# EAGLE design 2output (EAGLE 6.5.0)
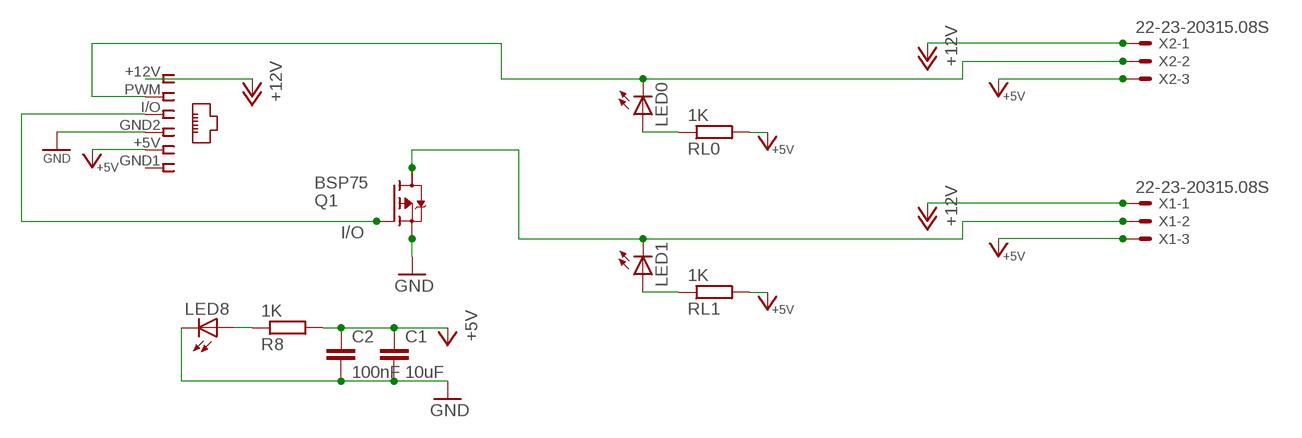
[diagram p0: schematic, sheet 1]

## Parts
C1  10uF  C-EUC1206  [C1206]
C2  100nF  C-EUC1206  [C1206]
I/O_PWM  I2C 1  RJ12STRAIGHT  [RJ12-STRAIGHT]
LED0  LED1206  [LED-1206]
LED1  LED1206  [LED-1206]
LED8  LED1206  [LED-1206]
Q1  BSP75  BSP613P  [PG-SOT-223]
R8  1K  R-EU_M1206  [M1206]
RL0  1K  R-EU_M1206  [M1206]
RL1  1K  R-EU_M1206  [M1206]
X1  22-23-20315.08S  [3-PIN-5.08S]
X2  22-23-20315.08S  [3-PIN-5.08S]

## Nets
+5V [highpower]: C1.1 C2.1 I/O_PWM.+5V R8.2 RL0.2 RL1.2 X1.3 X2.3
+12V [highpower]: I/O_PWM.+12V X1.1 X2.1
GND [highpower]: C1.2 C2.2 I/O_PWM.GND2 LED8.C Q1.3(S)
I/O: I/O_PWM.I/O Q1.1(G)
N$1 [power]: LED1.C Q1.2(D) X1.2
N$2: LED0.A RL0.1
N$4: LED1.A RL1.1
N$23: LED8.A R8.1
PWM [power]: I/O_PWM.PWM LED0.C X2.2
Unconnected: I/O_PWM.GND1 Q1.4(D)

## Library data of the parts
C1 C2 = rcl:C-EU: CAPACITOR, European symbol
I/O_PWM = lpatiny:RJ12: CORCOM Modular RJ Jacks No Shield Source: www.tycoelectronics.com .. ENG_DS_1654001_1099_RJ_L_0507.pdf
LED0 LED1 LED8 = SparkFun:LED: LEDs Standard schematic elements and footprints for 5mm, 3mm, 1206, and 0603 sized LEDs. 5mm - Spark Fun Electronics SKU : COM-00529 (and others)
Q1 = infineon:BSP613P: SIPMOS (R) Small-Signal-Transistor P-Channel (2 Drain) Source: http://www.infineon.com/dgdl/BSP613P_Rev2.4.pdf; OC_FARNELL: unknown; OC_NEWARK: unknown
R8 RL0 RL1 = resistor:R-EU_: RESISTOR, European symbol
X1 X2 = lpatiny:22-23-2031: .100" (2.54mm) Center Header - 3 Pin

## Net classes
0 default: width 0.61 mm
1 power: width 1.372 mm
2 highpower: width 1.372 mm

## Board
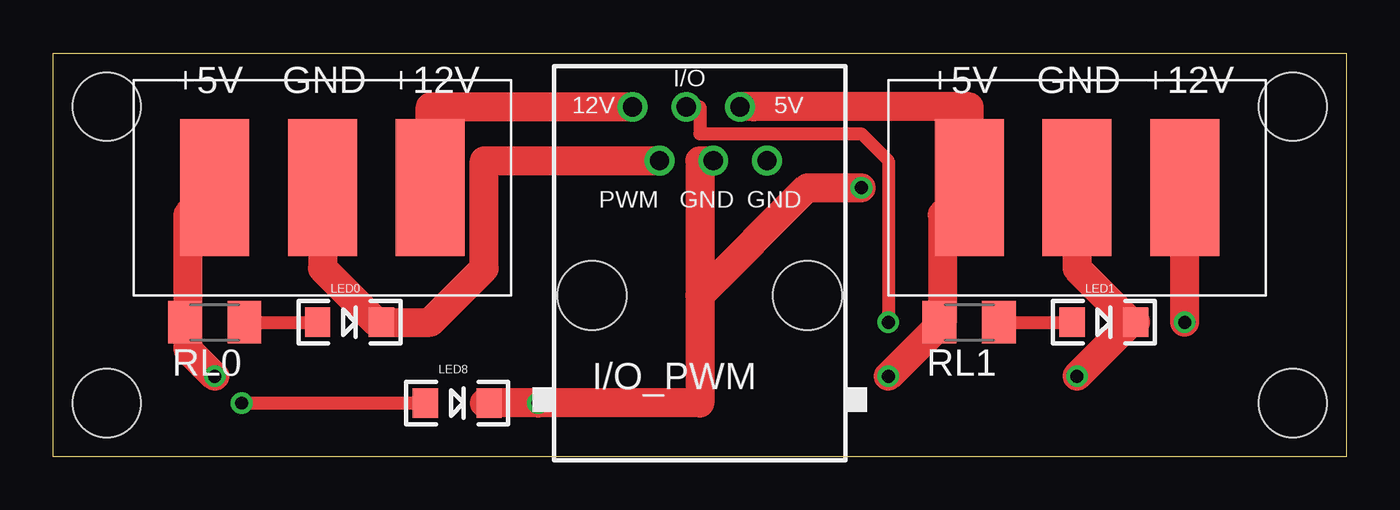
[diagram p1: board, top side]
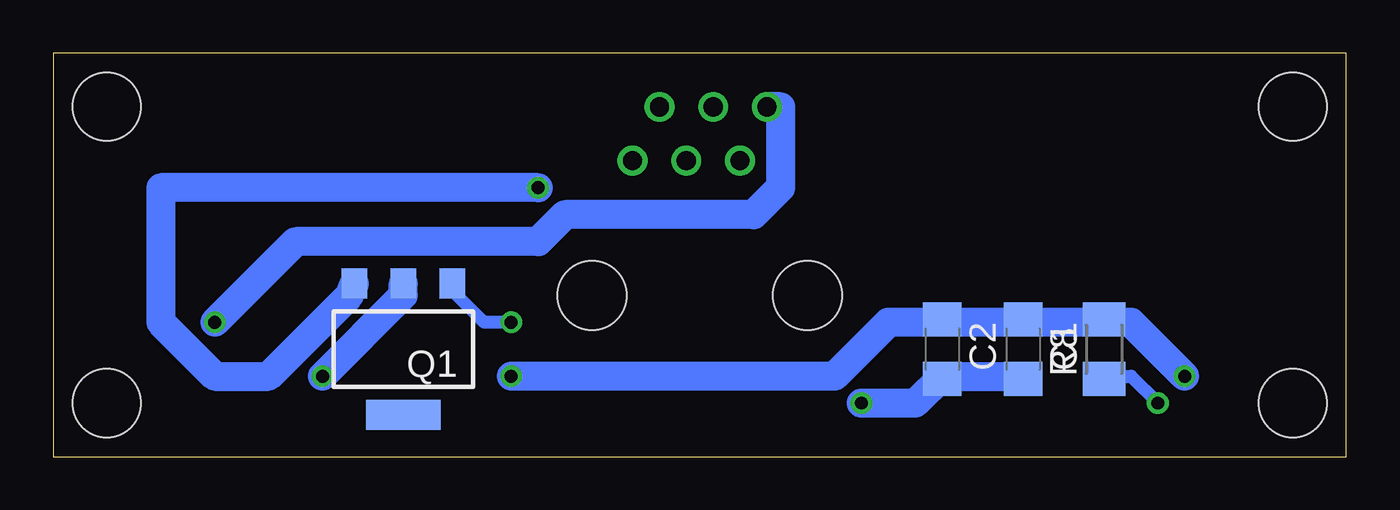
[diagram p2: board, bottom side, seen from below]

Size 60.96 x 19.05 mm. Coordinates in mm from the lower left corner, seen from the top.
Outline: 0,19.05 60.96,19.05 60.96,0 0,0 0,19.05
Copper layers (1*16): Top 0.035mm / dielectric 1.5mm / Bottom 0.035mm
Design rules "default": minimum track width 10mil, minimum drill 24mil, track to track 8mil, track to pad 8mil, pad to pad 8mil, via to via 8mil, smd to smd 8mil, copper to edge 40mil, drill to drill 8mil, minimum pad ring 10mil, minimum via ring 8mil, stop-mask expansion 4mil, vias tented up to drill 0mil, thermal gap 10mil
Holes 3.2 mm at 2.54,16.51 2.54,2.54 58.42,2.54 58.42,16.51
vRestrict: area 0,7.6 to 21.6,19.1; area 39.4,7.6 to 61,19.1
Milling: 4 lines

### Footprints (pad centres in the part's own frame; a part is rotated, then mirrored left to right if it is on the bottom)
C1206 = smd 1.6 x 1.8: 1 -1.4,0; 2 1.4,0
RJ12-STRAIGHT = drill 0.9 pad 1.4: +5V 1.905,8.89; +12V -3.175,8.89; GND1 3.175,6.35; GND2 0.635,6.35; I/O -0.635,8.89; PWM -1.905,6.35 | hole 3.251: -5.08,0; 5.08,0
LED-1206 = smd 1.2 x 1.4: A -1.5,0; C 1.5,0
PG-SOT-223 = smd 1.2 x 1.4: 1 -2.311,-3.099; 2 0,-3.099; 3 2.311,-3.099 | smd 3.5 x 1.4: 4 0,3.099
M1206 = smd 1.6 x 2: 1 -1.4,0; 2 1.4,0
3-PIN-5.08S = smd 3.251 x 6.452: 1 -5.08,0; 2 0,0; 3 5.08,0

### Placement (x,y rotation side)
C1  15.24,5.08 270 bottom
C2  19.05,5.08 270 bottom
I/O_PWM  30.48,7.62 0 top
LED0  13.97,6.35 0 top
LED1  49.53,6.35 0 top
LED8  19.05,2.54 0 top
Q1  44.45,5.08 180 bottom
R8  11.43,5.08 90 bottom
RL0  7.62,6.35 180 top
RL1  43.18,6.35 180 top
X1  48.26,12.7 180 top
X2  12.7,12.7 180 top

### Tracks (layer width: path | path; a pad name or v marks a point on that pad's centre or on a via)
+5V  (via drill 0.61)
  Top 1.372: 41.91,6.35 41.91,11.43 X1.3 43.18,16.51 33.02,16.51 I/O_PWM.+5V | 41.91,6.35 RL1.2 41.91,6.35 | 6.35,6.35 6.35,11.43 X2.3 | 6.35,6.35 RL0.2 6.35,6.35 | v7.62,3.81 6.35,5.08 6.35,6.35 | v39.37,3.81 41.91,6.35
  Bottom 1.372: 11.43,6.35 15.24,6.35 | 15.24,6.35 C1.1 15.24,6.35 | 11.43,6.35 R8.2 11.43,6.35 | 15.24,6.35 19.05,6.35 | 19.05,6.35 C2.1 19.05,6.35 | 11.43,6.35 10.16,6.35 v7.62,3.81 | v39.37,3.81 24.13,3.81 21.59,6.35 19.05,6.35
+12V  (via drill 0.61)
  Top 1.372: X2.1 17.78,16.51 26.67,16.51 I/O_PWM.+12V | v53.34,6.35 X1.1
  Bottom 1.372: v53.34,6.35 49.53,10.16 38.1,10.16 36.83,11.43 27.94,11.43 26.67,12.7 26.67,16.51 I/O_PWM.+12V
GND  (via drill 0.61)
  Top 1.372: LED8.C v22.86,2.54 30.48,2.54 30.48,7.62 | LED8.C 20.32,2.54 LED8.C | 30.48,7.62 30.48,13.97 I/O_PWM.GND2 | v38.1,12.7 35.56,12.7 30.48,7.62
  Bottom 1.372: 19.05,3.81 15.24,3.81 C1.2 | 19.05,3.81 C2.2 19.05,3.81 | v38.1,12.7 55.88,12.7 55.88,6.35 53.34,3.81 50.8,3.81 46.99,7.62 Q1.3 | 19.05,3.81 20.32,2.54 v22.86,2.54
I/O  (via drill 0.61)
  Top 0.61: v39.37,6.35 39.37,13.97 38.1,15.24 30.48,15.24 30.48,16.51 I/O_PWM.I/O
  Bottom 0.61: v39.37,6.35 40.64,6.35 41.91,7.62 Q1.1
N$1  (via drill 0.61)
  Top 1.372: 50.8,6.35 48.26,8.89 X1.2 | 50.8,6.35 LED1.C 50.8,6.35 | 50.8,6.35 v48.26,3.81
  Bottom 1.372: v48.26,3.81 44.45,7.62 Q1.2
N$2
  Top 0.61: RL0.1 8.89,6.35 RL0.1 | RL0.1 LED0.A | LED0.A 12.7,6.35 LED0.A
N$4
  Top 0.61: RL1.1 44.45,6.35 RL1.1 | RL1.1 LED1.A | LED1.A 48.26,6.35 LED1.A
N$23  (via drill 0.61)
  Top 0.61: v8.89,2.54 LED8.A | LED8.A 17.78,2.54 LED8.A
  Bottom 0.61: v8.89,2.54 10.16,3.81 11.43,3.81 R8.1
PWM
  Top 1.372: 15.24,6.35 12.7,8.89 X2.2 | 15.24,6.35 LED0.C | 15.24,6.35 LED0.C | LED0.C 17.78,6.35 20.32,8.89 20.32,13.97 27.94,13.97 I/O_PWM.PWM | 15.24,6.35 LED0.C

### Text on the board
tPlace: +5V | GND | +12V | +5V | GND | +12V